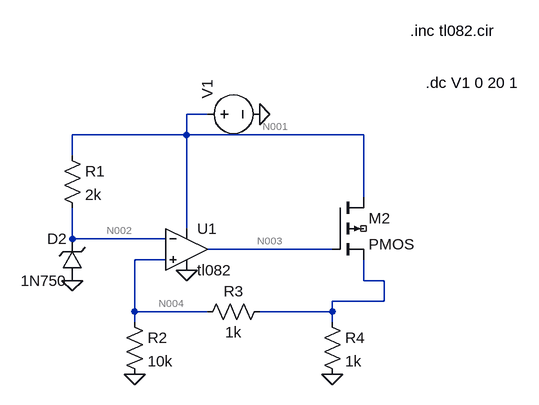
[diagram p0: schematic exp_10_1.asc]
exp_10_1.asc, the LTspice schematic file:
Version 4
SHEET 1 2308 680
WIRE 112 -160 80 -160
WIRE 80 -128 80 -160
WIRE 80 -128 -96 -128
WIRE 352 -128 80 -128
WIRE -96 -96 -96 -128
WIRE 352 -32 352 -128
WIRE 80 16 80 -128
WIRE -96 32 -96 -16
WIRE 48 32 -96 32
WIRE 304 48 112 48
WIRE 48 64 0 64
WIRE 352 96 352 64
WIRE 384 96 352 96
WIRE 384 128 384 96
WIRE 384 128 304 128
WIRE 0 144 0 64
WIRE 112 144 0 144
WIRE 304 144 304 128
WIRE 304 144 192 144
WIRE 0 160 0 144
WIRE 304 160 304 144
FLAG 80 80 0
FLAG 192 -160 0
FLAG 304 240 0
FLAG 0 240 0
FLAG -96 96 0
SYMBOL Opamps\\opamp2 80 -16 R0
SYMATTR InstName U1
SYMATTR Value tl082
SYMBOL voltage 96 -160 R270
WINDOW 123 0 0 Left 0
WINDOW 39 0 0 Left 0
SYMATTR InstName V1
SYMATTR Value ""
SYMBOL zener -80 96 R180
WINDOW 0 24 64 Left 2
WINDOW 3 24 0 Left 2
SYMATTR InstName D2
SYMATTR Value 1N750
SYMBOL res -112 -112 R0
SYMATTR InstName R1
SYMATTR Value 2k
SYMBOL res -16 144 R0
SYMATTR InstName R2
SYMATTR Value 10k
SYMBOL res 208 128 R90
WINDOW 0 0 56 VBottom 2
WINDOW 3 32 56 VTop 2
SYMATTR InstName R3
SYMATTR Value 1k
SYMBOL res 288 144 R0
SYMATTR InstName R4
SYMATTR Value 1k
SYMBOL pmos4 304 -32 R0
SYMATTR InstName M2
TEXT 424 -288 Left 2 !.inc tl082.cir
TEXT 448 -208 Left 2 !.dc V1 0 20 1

The netlist it stands for:
* exp_10_1.asc
XU1 N004 N002 N001 0 N003 tl082  ; pins In+ In- V+ V- OUT
V1 N001 0
D2 0 N002 1N750
R1 N001 N002 2k
R2 N004 0 10k
R3 N005 N004 1k
R4 N005 0 1k
M2 N001 N003 N005 NC_01 PMOS
.model D D
.lib standard.dio
.model NMOS NMOS
.model PMOS PMOS
.lib standard.mos
.inc tl082.cir
.dc V1 0 20 1
.backanno
.end

* Results of the author's LTspice run, read from the files saved beside the schematic
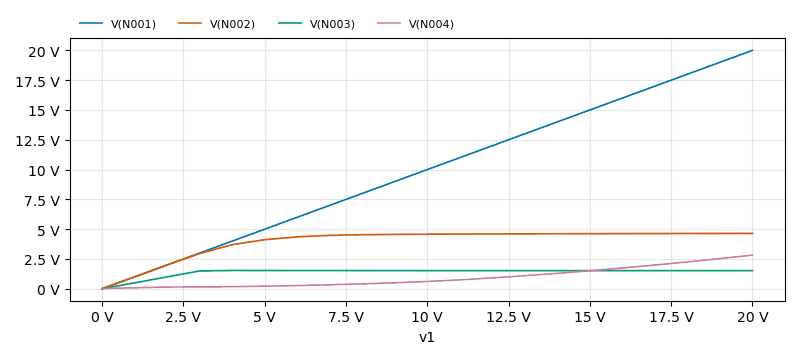
[diagram p1: DC transfer characteristic of exp_10_1.asc, plotted from the saved traces]
* DC transfer characteristic, 1 run:
*   V(N001): 0 V at v1=0 V, 20 V at v1=20 V, min 0 V, max 20 V
*   V(N002): 33.87 mV at v1=0 V, 4.648 V at v1=20 V, min 33.87 mV, max 4.648 V
*   V(N003): -2.068e-05 fV at v1=0 V, 1.522 V at v1=20 V, min -2.068e-05 fV, max 1.536 V
*   V(N004): 31.25 mV at v1=0 V, 2.824 V at v1=20 V, min 31.25 mV, max 2.824 V